# Altium project rst1.PrjPcb
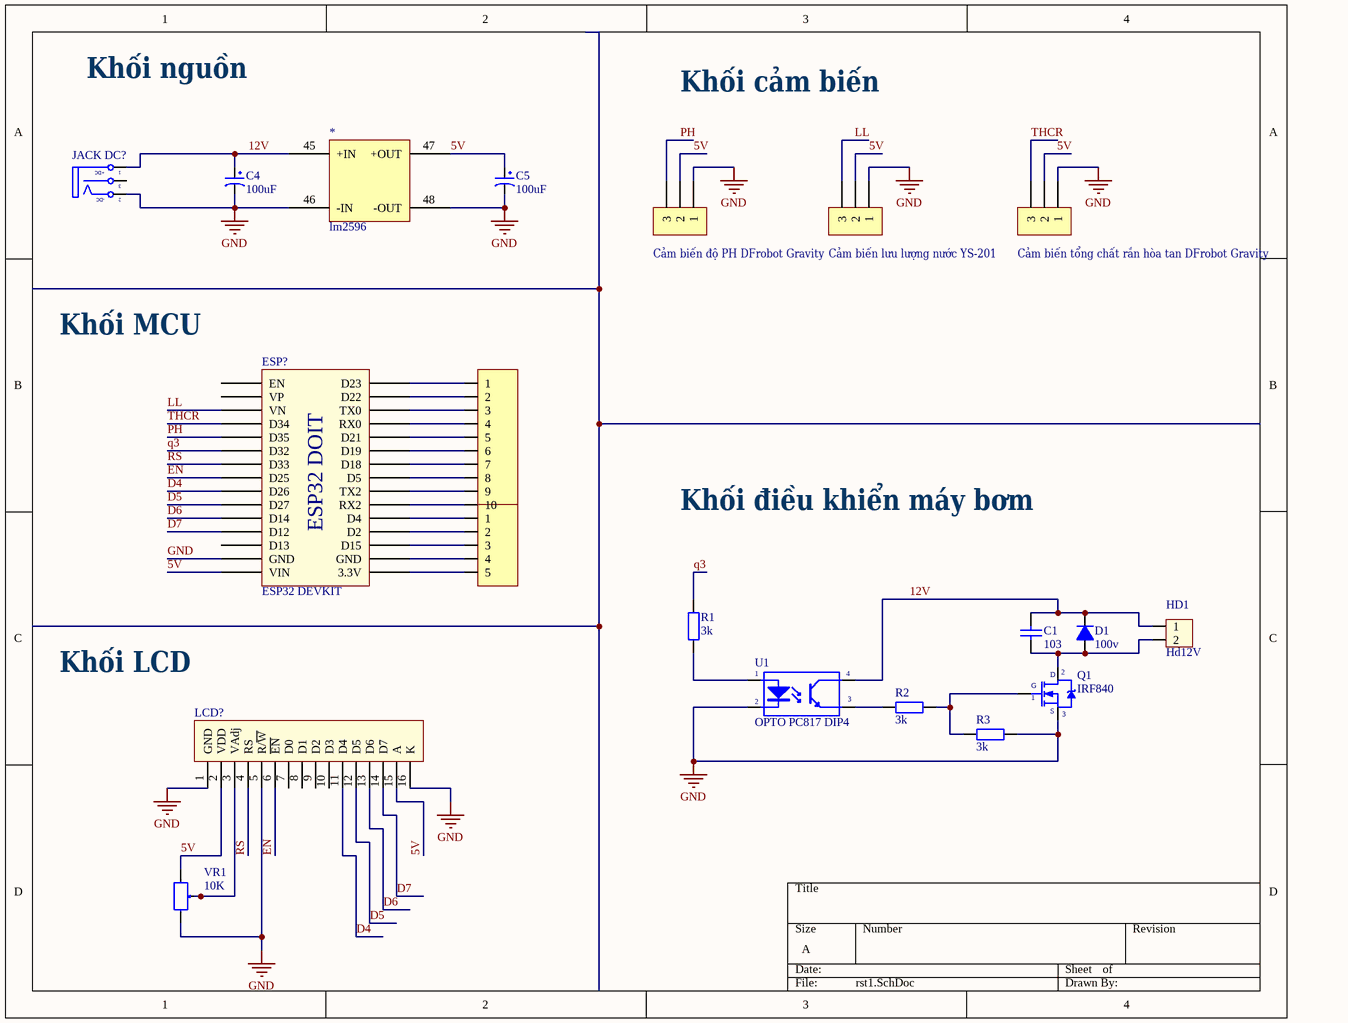
[diagram p0: rst1.SchDoc]
1 sheet, 21 parts. Net scope: global (net labels, ports and power ports of the same name join across sheets).
Board file: rst1.PcbDoc

## Sheet rst1.SchDoc
size A; SheetNumber: 1; SheetTotal: 1

### Parts
(Parts that share a designator on the sheet are numbered #1, #2 ... from top to bottom, then left to right.)
*  lm2596  [PCBComponent_1]
?  (no value)
C1  103  [tu gom]
C4  100uF  [tu hoa 5mm]
C5  100uF  [tu hoa 5mm]
D1  100v  [DIODE 1A]
ESP?  ESP32 DEVKIT  [ESP32 WROOM 32 KIT]
H1  Cảm biến lưu lượng nước YS-201  [XH2.54M-3]
H2  Cảm biến tổng chất rắn hòa tan DFrobot Gravity  [XH2.54M-3]
H3  Cảm biến độ PH DFrobot Gravity  [XH2.54M-3]
HD1  Hd12V  [HED2]
JACK_DC?  (no value)  [JACK DC 5.5]
JP?#1  (no value)  [JP 1x10 DT]
JP?#2  (no value)  [JP 1x5 DT]
LCD?  (no value)  [LCD1602 with Jump]
Q1  IRF840  [QTO-220]
R1  3k  [tro vach 1/4w]
R2  3k  [tro vach 1/4w]
R3  3k  [tro vach 1/4w]
U1  OPTO PC817 DIP4  [DIP4]
VR1  10K  [VR]

### Nets
GND: *.46(-IN) *.48(-OUT) C4.2 C5.2 ESP?.14(GND) H1.1 H2.1 H3.1 JACK_DC?.2(TN) LCD?.1(GND) LCD?.5(R/~{W}) LCD?.16(K) Q1.3(S) R3.1 U1.2(K) VR1.3
5V: *.47(+OUT) C5.1 ESP?.15(VIN) H1.2 H2.2 H3.2 LCD?.2(VDD) LCD?.15(A) VR1.1
12V: *.45(+IN) C1.1 C4.1 D1.2(K) HD1.1 JACK_DC?.1(T) U1.4(C)
D4: ESP?.9(D26) LCD?.11(D4)
D5: ESP?.10(D27) LCD?.12(D5)
D6: ESP?.11(D14) LCD?.13(D6)
D7: ESP?.12(D12) LCD?.14(D7)
EN: ESP?.8(D25) LCD?.6(~{EN})
LL: ESP?.3(VN) H1.3
PH: ESP?.5(D35) H3.3
q3: ESP?.6(D32) R1.2
RS: ESP?.7(D33) LCD?.4(RS)
THCR: ESP?.4(D34) H2.3
NetC1_2: C1.2 D1.1(A) HD1.2 Q1.2(D)
NetESP?_16: ESP?.16(3.3V) JP?#2.5
NetESP?_17: ESP?.17(GND) JP?#2.4
NetESP?_18: ESP?.18(D15) JP?#2.3
NetESP?_19: ESP?.19(D2) JP?#2.2
NetESP?_20: ESP?.20(D4) JP?#2.1
NetESP?_21: ESP?.21(RX2) JP?#1.10
NetESP?_22: ESP?.22(TX2) JP?#1.9
NetESP?_23: ESP?.23(D5) JP?#1.8
NetESP?_24: ESP?.24(D18) JP?#1.7
NetESP?_25: ESP?.25(D19) JP?#1.6
NetESP?_26: ESP?.26(D21) JP?#1.5
NetESP?_27: ESP?.27(RX0) JP?#1.4
NetESP?_28: ESP?.28(TX0) JP?#1.3
NetESP?_29: ESP?.29(D22) JP?#1.2
NetESP?_30: ESP?.30(D23) JP?#1.1
NetLCD?_3: LCD?.3(VAdj) VR1.2
NetQ1_1: Q1.1(G) R2.1 R3.2
NetR1_1: R1.1 U1.1(A)
NetR2_2: R2.2 U1.3(E)

Not connected (* = marked no-connect by the designer): ESP? 1(EN) 2(VP) 13(D13); JACK_DC? 3(S); LCD? 7(D0) 8(D1) 9(D2) 10(D3)

### Notes on the sheet
- Labels drawn without touching a wire or pin: Khối cảm biến, Khối LCD, Khối MCU, Khối nguồn, Khối điều khiển máy bơm
- (in symbol ESP32 WROOM 32 KIT) ESP32 DOIT
- (in symbol JACK DC 5.5) +DC; -DC

### Library data of the parts
* = xl4015
? = Component_1
C1 = Tu gom 103 50V: Cắm; So_Chan: 2; Ten_Linh_Kien: Tụ gốm 103 10nF 50V; Don_Vi: Con; Ma_Hang: MH000936; Chung_Loai: Cắm; Kieu_Chan: *
C4 C5 = Tu Hoa 100uF 16V 5x11: Cắm; Don_Vi: Con; So_Chan: 2; Ten_Linh_Kien: Tụ Hóa 100uF 16V 5x11MM; Ma_Hang: MH008417; Chung_Loai: Cắm; Kieu_Chan: *
D1 = Diode 1N4007: Cắm; Ten_Linh_Kien: Diode 1N4007 1A (DIP); Don_Vi: Con; Ma_Hang: MH001063; Ghi Chu: *; Kieu_Chan: *; Chung_Loai: Cắm
ESP? = ESP32 WROOM 32 KIT
H1-H3 = Header 3P 2.54 Duc Thang: Cắm; Ten_Linh_Kien: Header 3P XH2.54-3P Đực Thẳng; Don_Vi: Con; Ma_Hang: MH001292; Chung_Loai: Cắm
HD1 = Hed2: Header 2 (Green); Value: Header 2
JACK_DC? = JACK DC 5.5: Value: Jac DC
JP?#1 = JP 1x10 2.54 Duc Thang: Cắm; Ten_Linh_Kien: Jump Đơn Đực 2.54MM 1x40P Thẳng 11MM; Don_Vi: Con; Ma_Hang: MH000903; Ghi_Chu: *; Kieu_Chan: *; Chung_Loai: Cắm
JP?#2 = JP 1x5 2.54 Duc Thang: Cắm; Ten_Linh_Kien: Jump Đơn Đực 2.54MM 1x40P Thẳng 11MM; Don_Vi: Con; Ma_Hang: MH000903; Ghi_Chu: *; Kieu_Chan: *; Chung_Loai: Cắm
LCD? = LCD1602 XL: LCD 1602 Xanh Lá; Ten: Màn hình LCD 1602 Xanh Lá; Ma_Hang: 67HZ; NCC: NSHOP; CHIP: HD44780
Q1 = IRF840: MOSFET N - CHANNEL 500V - 0.75 - 8A - TO-220; Value: IRF840
R1-R3 = Tro Vach 1/4W 5% 1k: Cắm; Don_Vi: Con; So_Chan: 2; Ten_Linh_Kien: Trở Vạch 1/4w 5% 1k; Ma_Hang: MH007390; Chung_Loai: Cắm; Kieu_Chan: *
U1 = OPTO PC817 DIP4: Single Opto; Value: PC817
VR1 = VR: Var Resistor; Value: VR 10K